# EAGLE design TOS100-Shield_v16 (EAGLE 7.7.0)
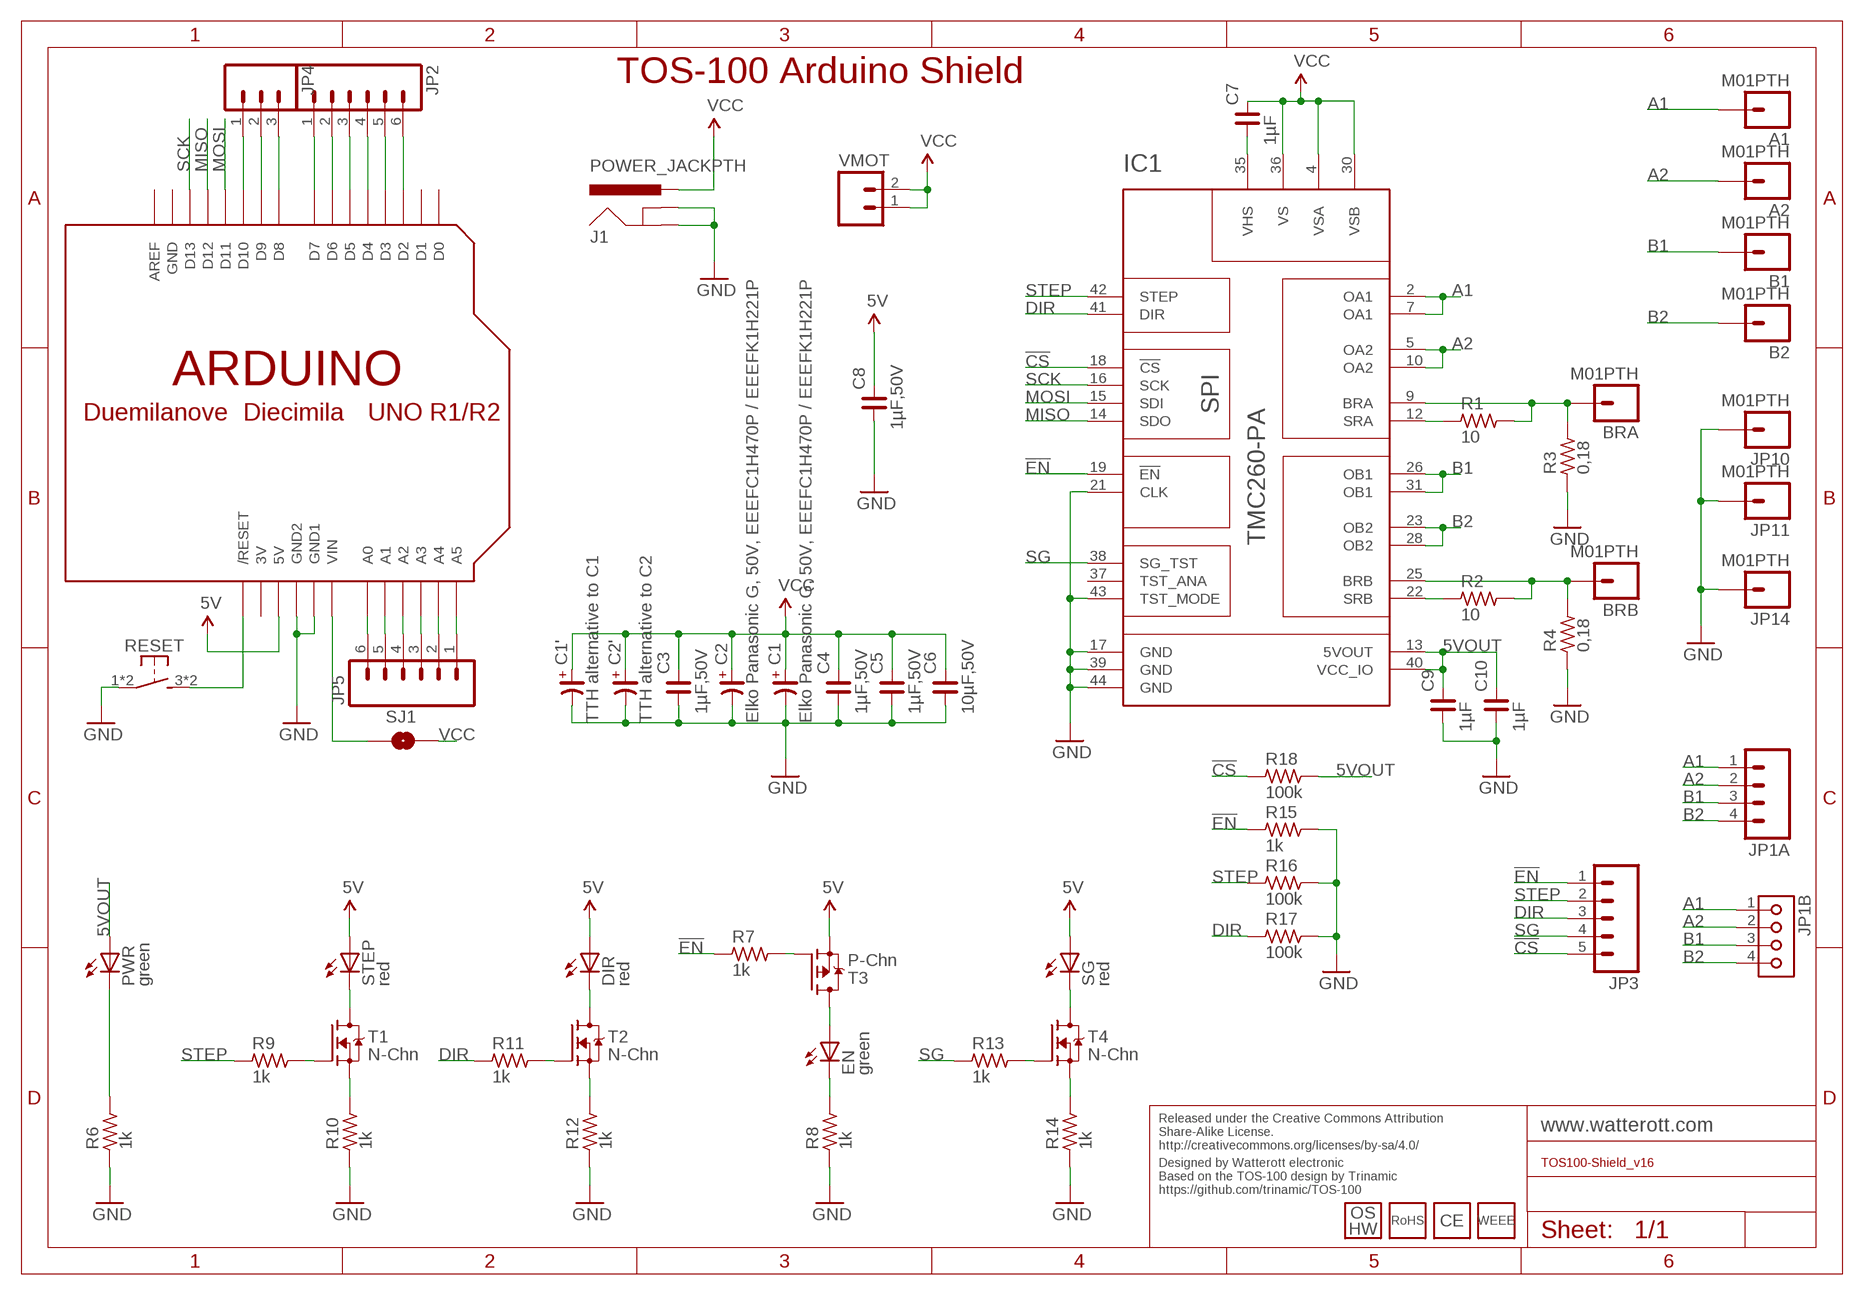
[diagram p0: schematic, sheet 1]

## Parts
A1  M01PTH  [1X01]
A2  M01PTH  [1X01]
ARD  ARDUINOUNO  [ARDUINO]
B1  M01PTH  [1X01]
B2  M01PTH  [1X01]
BRA  M01PTH  [1X01]
BRB  M01PTH  [1X01]
C1  Elko Panasonic G, 50V, EEEFC1H470P / EEEFK1H221P  CP_SV-G  [CSV-G]
C1'  TTH alternative to C1  CP_E-035X100  [CE-035X100]
C2  Elko Panasonic G, 50V, EEEFC1H470P / EEEFK1H221P  CP_SV-G  [CSV-G]
C2'  TTH alternative to C2  CP_E-035X100  [CE-035X100]
C3  1µF,50V  C_0603  [C0603]
C4  1µF,50V  C_0603  [C0603]
C5  1µF,50V  C_0603  [C0603]
C6  10µF,50V  C_1206  [C1206]
C7  1µF  C_0603  [C0603]
C8  1µF,50V  C_0603  [C0603]
C9  1µF  C_0603  [C0603]
C10  1µF  C_0603  [C0603]
DIR  red  LED-0603  [C0603]
EN  green  LED-0603  [C0603]
IC1  TMC260-PA  [PQFP44_WITH_PADS]
J1  POWER_JACKPTH  [POWER_JACK_PTH]
JP1A  M04SCREW  [SCREWTERMINAL-3.5MM-4]
JP1B  KK4H  [KK-H-4]
JP2  M06SIP  [1X06]
JP3  M05PTH  [1X05]
JP4  M03PTH  [1X03]
JP5  M06SIP  [1X06]
JP10  M01PTH  [1X01]
JP11  M01PTH  [1X01]
JP14  M01PTH  [1X01]
LOGO1  LOGO_OSHW-5  [OSHW_5MM]
LOGO2  LOGO_CE-2  [CE_2MM]
LOGO3  LOGO_WEEE-4  [WEEE_4MM]
LOGO4  LOGO_ROHS-2  [ROHS_2MM]
PWR  green  LED-0603  [C0603]
R1  10  R_0603  [R0603]
R2  10  R_0603  [R0603]
R3  0,18  R_2512  [R2512]
R4  0,18  R_2512  [R2512]
R6  1k  R_0603  [R0603]
R7  1k  R_0603  [R0603]
R8  1k  R_0603  [R0603]
R9  1k  R_0603  [R0603]
R10  1k  R_0603  [R0603]
R11  1k  R_0603  [R0603]
R12  1k  R_0603  [R0603]
R13  1k  R_0603  [R0603]
R14  1k  R_0603  [R0603]
R15  1k  R_0603  [R0603]
R16  100k  R_0603  [R0603]
R17  100k  R_0603  [R0603]
R18  100k  R_0603  [R0603]
RESET  PTS645SH50SMTR92-Grey  SW-TACTILE-6X6_SMD  [SW6X6_SMD]
SG  red  LED-0603  [C0603]
SJ1  SOLDERJUMPERNO  [SJ_2S-NO]
STEP  red  LED-0603  [C0603]
T1  N-Chn  MOSFET-N-SOT23  [SOT23]
T2  N-Chn  MOSFET-N-SOT23  [SOT23]
T3  P-Chn  MOSFET-P-SOT23  [SOT23]
T4  N-Chn  MOSFET-N-SOT23  [SOT23]
VMOT  M021X02_NO_SILK  [1X02_NO_SILK]

## Nets
5V: ARD.5V C8.2 DIR.A SG.A STEP.A T3.2(S)
5VOUT: C9.2 C10.2 IC1.13(5VOUT) IC1.40(VCC_IO) PWR.A R18.2
!CS: IC1.18(!CS) JP3.5 R18.1
!EN: IC1.19(!EN) JP3.1 R7.1 R15.1
A1: A1.1 IC1.2(OA1) IC1.7(OA1) JP1A.1 JP1B.1
A2: A2.1 IC1.5(OA2) IC1.10(OA2) JP1A.2 JP1B.2
B1: B1.1 IC1.26(OB1) IC1.31(OB1) JP1A.3 JP1B.3
B2: B2.1 IC1.23(OB2) IC1.28(OB2) JP1A.4 JP1B.4
DIR: IC1.41(DIR) JP3.3 R11.1 R17.1
GND: ARD.GND1 ARD.GND2 C1'.- C1.- C2'.- C2.- C3.1 C4.1 C5.1 C6.1 C8.1 C9.1 C10.1 IC1.17(GND) IC1.21(CLK) IC1.39(GND) IC1.43(TST_MODE) IC1.44(GND) J1.GND J1.GNDBREAK JP10.1 JP11.1 JP14.1 R3.1 R4.1 R6.1 R8.1 R10.1 R12.1 R14.1 R15.2 R16.2 R17.2 RESET.1 RESET.2(P1)
MISO: ARD.D12 IC1.14(SDO)
MOSI: ARD.D11 IC1.15(SDI)
N$1: ARD.D10 JP4.1
N$2: ARD.D9 JP4.2
N$3: ARD.D8 JP4.3
N$4: ARD.D7 JP2.1
N$5: ARD.D6 JP2.2
N$6: ARD.D5 JP2.3
N$7: ARD.D4 JP2.4
N$8: ARD.D3 JP2.5
N$9: ARD.D2 JP2.6
N$10: ARD.A5 JP5.1
N$11: ARD.A4 JP5.2
N$12: ARD.A3 JP5.3
N$13: ARD.A2 JP5.4
N$14: ARD.A1 JP5.5
N$15: ARD.A0 JP5.6
N$16: R9.2 T1.1(G)
N$17: ARD.RESET(/RESET) RESET.3(S1) RESET.4(S1)
N$19: STEP.C T1.3(D)
N$20: R10.2 T1.2(S)
N$22: PWR.C R6.2
N$24: R11.2 T2.1(G)
N$25: DIR.C T2.3(D)
N$26: R12.2 T2.2(S)
N$27: EN.A T3.3(D)
N$28: BRA.1 IC1.9(BRA) R1.2 R3.2
N$29: IC1.12(SRA) R1.1
N$30: BRB.1 IC1.25(BRB) R2.2 R4.2
N$31: IC1.22(SRB) R2.1
N$35: EN.C R8.2
N$36: R7.2 T3.1(G)
N$38: R13.2 T4.1(G)
N$39: SG.C T4.3(D)
N$40: R14.2 T4.2(S)
SCK: ARD.D13 IC1.16(SCK)
SG: IC1.38(SG_TST) JP3.4 R13.1
STEP: IC1.42(STEP) JP3.2 R9.1 R16.1
VCC: C1'.+ C1.+ C2'.+ C2.+ C3.2 C4.2 C5.2 C6.2 C7.2 IC1.4(VSA) IC1.30(VSB) IC1.36(VS) J1.PWR SJ1.2 VMOT.1 VMOT.2
VHS: C7.1 IC1.35(VHS)
VIN: ARD.VIN SJ1.1
Unconnected: ARD.AREF ARD.D0 ARD.D1 IC1.37(TST_ANA)

## Notes on the sheet
- TOS-100 Arduino Shield
- Released under the Creative Commons Attribution 
  Share-Alike License.
  http://creativecommons.org/licenses/by-sa/4.0/
- Designed by Watterott electronic
  Based on the TOS-100 design by Trinamic
  https://github.com/trinamic/TOS-100

## Power pins joined to a net without a drawn wire
3V: ARD.3V
GND: ARD.GND

## Library data of the parts
A1 A2 B1 B2 BRA BRB JP10 JP11 JP14 = SparkFun:M01: Header 1 Standard 1-pin 0.1" header. Use with straight break away headers (SKU : PRT-00116), right angle break away headers (PRT-00553), swiss pins (PRT-00743), machine pins (PRT-00117), and female headers (PRT-00115).
ARD = adafruit:ARDUINO: Arduino Diecimila/Duemilanove Make a shield with ease, this package has all the named pins as well as the two mounting drill holes and an outline of the USB and DC power connector. The outline is on the DIMENSION layer, so if your board house uses it they will cut the outline to match. http://www.ladyada.net/library/pcb/eaglelibrary.html
C1 C1' C2 C2' = rc-master:CP_: POLARIZED CAP
C3-C10 = rc-master-smd:C_: NON-POLARIZED CAP
DIR EN PWR SG STEP = we-opto:LED: LED red, green, blue -> 0603
IC1 = trinamic-2:TMC260-PA: TRINAMIC Energy Efficient Microstep Driver for up to 1.7A with coolStep™ Information given in this library is believed to be accurate and reliable. However no warranty is given for its correctness. Datasheet for TMC260/261/262 <http://www.trinamic.com/tmc/media/Downloads/integrated_circuits/TMC262/TMC260_TMC261_TMC262_datasheet.pdf> Description Energy Efficient Microstep Driver for up to 1.7A with coolStep™ The TMC260 is the first energy efficient high precision microstepping driver IC for bipolar stepper motors with integrated power MOSFETs. The unique high resolution sensorless load detection stallGuard2™ is used to for the world™s first integrated load dependent current control feature called coolStep™. The ability to read out the load and detect an overload makes the TMC260 an optimum choice for drives where a high reliability is desired at a low cost. The new patented spreadCycle PWM mixed decay chopper scheme ensures best zero crossing performance as well as high speed operation. The TMC260 can be driven with Step & Direction signals as well as by serial SPI™ interface. Using the microPlyer allows to operate the motor with highest 256 ™Step smoothness reducing the input frequency to 16 ™Steps. A full set of protection and diagnostic features makes this device very rugged. It directly drives stepper motors with up to 1.7A. This way it reaches highest energy efficiency and allows driving of a high motor current without cooling measures even at high environment temperatures. Specifications Main characteristics 2-phase bipolar stepper motor driver stallGuard2™ sensorless load detection coolStep™ load dependent current control save up to 80% energy spreadCycle hysteresis PWM chopper best current zero crossing performance best sine wave form 256 ™Steps/fullstep (51200 pos/rev.) with a standard 200 step motor microPlyer 16-to-256 ™Step multiplyer full protection and diagnostics lowest power dissipation programmable slope control for low EME standby and shutdown mode stall / load detection output Low power consumption via low RDS-ON power stage Interface Step & Direction easy-to-use SPI™ (20bit) Electrical Data up to 1.7A coil current (peak) 9V to 40V motor supply 3.3V or 5V operation for digital part Package TQFP44 10x10 mm² package RoHS compliant
J1 = SparkFun:POWER_JACK: Power Jack This is the standard 5.5mm barrel jack for power. The PTH is the most common, proven, reliable, footprint. All others are experimental. The Slot footprint only works if the mill layer is transmitted to the PCB fab house so be warned. Spark Fun Electronics SKU : PRT-00119. Mating wall wart : TOL-00298 (and others)
JP1A = SparkFun:M04: Header 4 Standard 4-pin 0.1" header. Use with straight break away headers (SKU : PRT-00116), right angle break away headers (PRT-00553), swiss pins (PRT-00743), machine pins (PRT-00117), and female headers (PRT-00115). Molex polarized connector foot print use with SKU : PRT-08231 with associated crimp pins and housings.
JP1B = molex-kk:KK4*
JP2 JP5 = SparkFun:M06: Header 6 Standard 6-pin 0.1" header. Use with straight break away headers (SKU : PRT-00116), right angle break away headers (PRT-00553), swiss pins (PRT-00743), machine pins (PRT-00117), and female headers (PRT-00115). Molex polarized connector foot print use with SKU : PRT-08094 with associated crimp pins and housings. NOTES ON THE VARIANTS LOCK and LOCK_LONGPADS... This footprint was designed to help hold the alignment of a through-hole component (i.e. 6-pin header) while soldering it into place. You may notice that each hole has been shifted either up or down by 0.005 of an inch from it's more standard position (which is a perfectly straight line). This slight alteration caused the pins (the squares in the middle) to touch the edges of the holes. Because they are alternating, it causes a "brace" to hold the component in place. 0.005 has proven to be the perfect amount of "off-center" position when using our standard breakaway headers. Although looks a little odd when you look at the bare footprint, once you have a header in there, the alteration is very hard to notice. Also, if you push a header all the way into place, it is covered up entirely on the bottom side. This idea of altering the position of holes to aid alignment will be further integrated into the Sparkfun Library for other footprints. It can help hold any component with 3 or more connection pins.
JP3 = SparkFun:M05: Header 5 Standard 5-pin 0.1" header. Use with straight break away headers (SKU : PRT-00116), right angle break away headers (PRT-00553), swiss pins (PRT-00743), machine pins (PRT-00117), and female headers (PRT-00115). Molex polarized connector foot print use with SKU : PRT-08230 with associated crimp pins and housings.
JP4 = SparkFun:M03: Header 3 Standard 3-pin 0.1" header. Use with straight break away headers (SKU : PRT-00116), right angle break away headers (PRT-00553), swiss pins (PRT-00743), machine pins (PRT-00117), and female headers (PRT-00115). Molex polarized connector foot print use with SKU : PRT-08232 with associated crimp pins and housings.
LOGO1 = we-symbol:LOGO_OSHW: Open-Source-Hardware Logo
LOGO2 = we-symbol:LOGO_CE: CE Logo
LOGO3 = we-symbol:LOGO_WEEE: WEEE Logo
LOGO4 = we-symbol:LOGO_ROHS: RoHS Logo
R1-R4 R6-R18 = rc-master-smd:R_: RESISTOR
RESET = we-switch:SW-TACTILE: Tactile Switche
SJ1 = SparkFun:SOLDERJUMPER: Solder Jumper Standard SMD solder jumper. Used to automate production. Two varients : Normally Open and Normally Closed are the same, but have different paste layers. NC will have a large amount of paste and should jumper during reflow.
T1 T2 T4 = we-transistor:MOSFET-N: N-Channel MOSFET SOT23 N-Chn MOSFET TSM3404, TSM240N03 (Vgs>=+/-20V, Vds<=30V, Id>=3A + Rds<=0.05Ohm @ Vgs=4.5V) BSS138 (Vgs>=+/-20V, Vds<=40V, Id>=0.2A + Rds<=3Ohm @ Vgs=4.5V) SOT223 Low Side Switch with Protection (Infineon) BSP76 (Vin=0...10V, Vds<=42V, Id=1.4A + Rds=0.2Ohm @ Vin=5V) BSP77 (Vin=0...10V, Vds<=42V, Id=2.2A + Rds=0.1Ohm @ Vin=5V) D²Pak Low Side Switch with Protection (Infineon) BTS117TC (Vin=0...10V, Vds<=60V, Id=3.5A + Rds=0.12Ohm @ Vin=5V) BTS133TC (Vin=0...10V, Vds<=60V, Id=7A + Rds=0.06Ohm @ Vin=5V) BTS141TC (Vin=0...10V, Vds<=60V, Id=12A + Rds=0.03Ohm @ Vin=5V) BTS3018TC (Vin=0...10V, Vds<=60V, Id=6A + Rds=0.02Ohm @ Vin=5V)
T3 = we-transistor:MOSFET-P: P-Channel MOSFET SOT23 P-Chn MOSFET TSM3401 (Vgs>=+/-20V, Vds>=30V, Id>=2A + Rds<=0.1Ohm @ Vgs=4.5V)
VMOT = SparkFun:M02: Header 2 Standard 2-pin 0.1" header. Use with straight break away headers (SKU : PRT-00116), right angle break away headers (PRT-00553), swiss pins (PRT-00743), machine pins (PRT-00117), and female headers (PRT-00115). Molex polarized connector foot print use with SKU : PRT-08233 with associated crimp pins and housings.

## Board
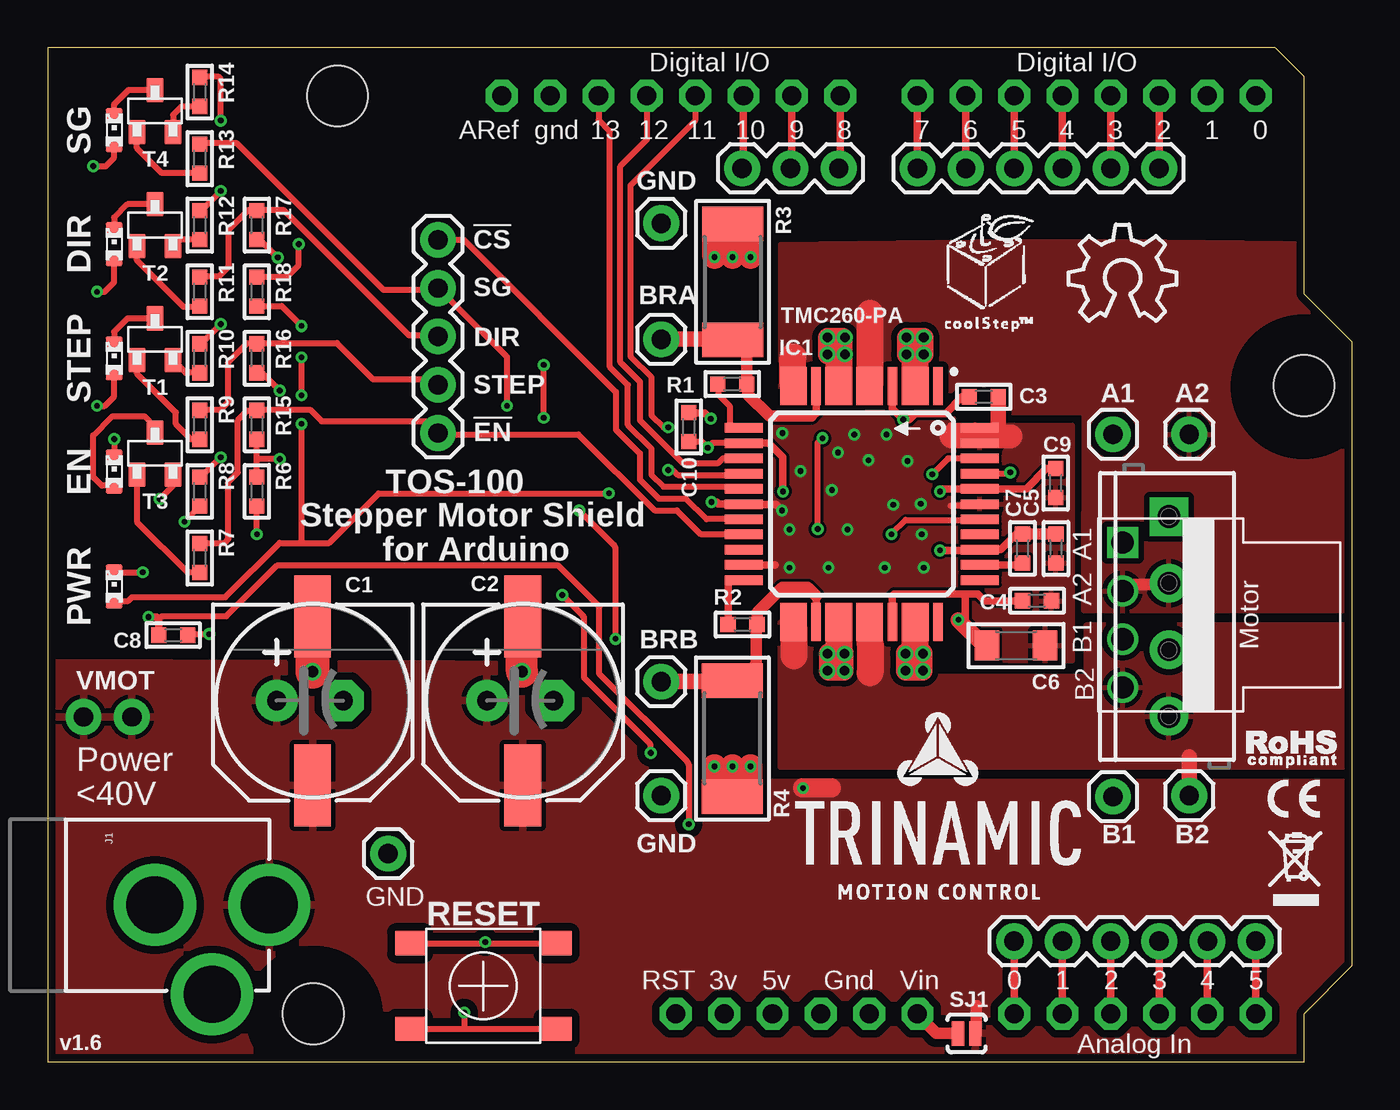
[diagram p1: board, top side]
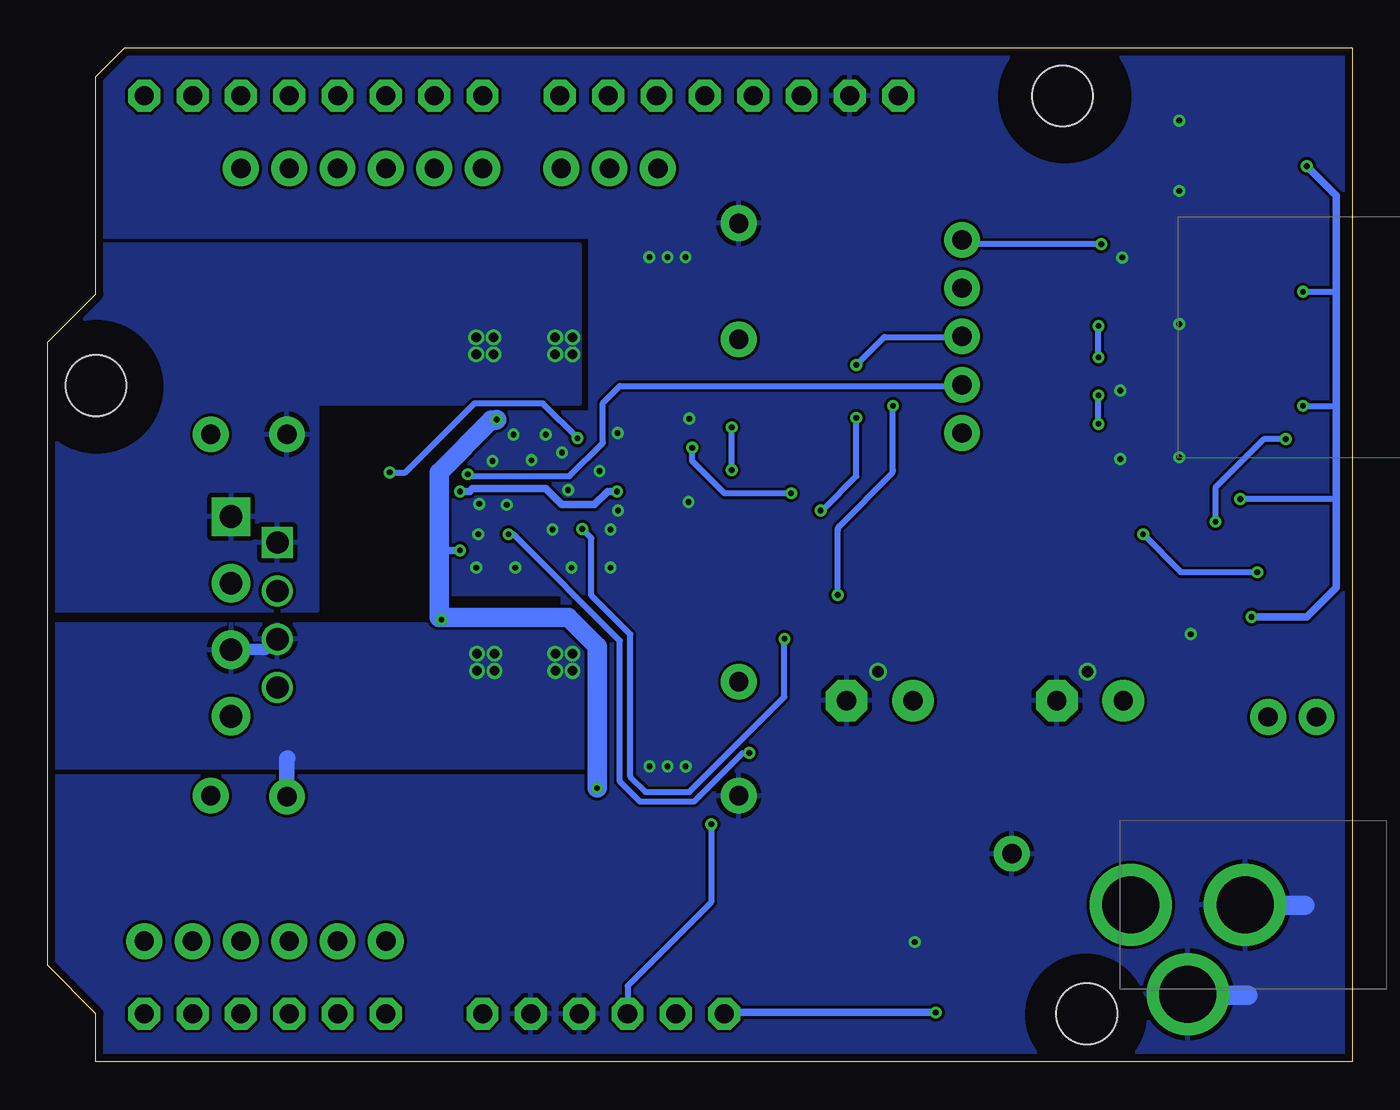
[diagram p2: board, bottom side, seen from below]

Size 68.58 x 53.34 mm. Coordinates in mm from the lower left corner, seen from the top.
Copper layers (1*16): Top 0.035mm / dielectric 1.5mm / Bottom 0.035mm
Design rules "we-dru-2-layer": minimum track width 6mil, minimum drill 0.3mm, track to track 6mil, track to pad 7mil, pad to pad 8mil, via to via 8mil, smd to smd 4mil, copper to edge 0.4mm, drill to drill 0.4mm, minimum pad ring 0.18mm, minimum via ring 0.16mm, stop-mask expansion 0.1mm, vias tented up to drill 0.5mm, thermal gap 0.25mm
tRestrict: area 10.8,-0.7 to 17.2,5.7; area 62.5,32 to 69.5,39; area 11.6,47.2 to 18.6,54.2
bRestrict: area 10.8,-0.7 to 17.2,5.7; area 62.5,32 to 69.5,39; area 11.6,47.2 to 18.6,54.2

### Footprints (pad centres in the part's own frame; a part is rotated, then mirrored left to right if it is on the bottom)
1X01 = drill 1.016 pad 1.88: 1 0,0
ARDUINO = drill 1 pad 1.676 octagon: 3V 35.56,2.54; 5V 38.1,2.54; A0 50.8,2.54; A1 53.34,2.54; A2 55.88,2.54; A3 58.42,2.54; A4 60.96,2.54; A5 63.5,2.54; AREF 23.876,50.8; D0 63.5,50.8; D1 60.96,50.8; D2 58.42,50.8; D3 55.88,50.8; D4 53.34,50.8; D5 50.8,50.8; D6 48.26,50.8; D7 45.72,50.8; D8 41.656,50.8; D9 39.116,50.8; D10 36.576,50.8; D11 34.036,50.8; D12 31.496,50.8; D13 28.956,50.8; GND 26.416,50.8; GND1 43.18,2.54; GND2 40.64,2.54; RESET 33.02,2.54; VIN 45.72,2.54 | hole 3.2: 15.24,50.8; 66.04,35.56; 13.97,2.54
CSV-G = smd 4.318 x 1.93: + -4.445,0; - 4.445,0
CE-035X100 = drill 1.016 pad 2.184: + -1.905,0 | drill 1.016 pad 2.184 octagon: - 1.587,0
C0603 = smd 0.8 x 0.8: 1 -0.762,0; 2 0.762,0
C1206 = smd 1.3 x 1.6: 1 -1.524,0; 2 1.524,0
C0603' = smd 0.9 x 0.8: A 0,-0.75; C 0,0.75
PQFP44_WITH_PADS = smd 2 x 0.5: 1 -6.327,4.254; 4 -6.327,1.854; 9 -6.327,-2.146; 25 6.073,-2.146; 30 6.073,1.854; 33 6.073,4.254 | smd 2 x 1.4: 2 -6.327,3.06; 5 -6.327,0.66; 7 -6.327,-0.965; 10 -6.327,-3.34; 23 6.073,-3.34; 26 6.073,-0.965; 28 6.073,0.66; 31 6.073,3.06 | smd 0.5 x 2: 12 -4.127,-5.946; 13 -3.327,-5.946; 14 -2.527,-5.946; 15 -1.727,-5.946; 16 -0.927,-5.946; 17 -0.127,-5.946; 18 0.673,-5.946; 19 1.473,-5.946; 20 2.273,-5.946; 21 3.073,-5.946; 22 3.873,-5.946; 34 3.873,6.454; 35 3.073,6.454; 36 2.273,6.454; 37 1.473,6.454; 38 0.673,6.454; 39 -0.127,6.454; 40 -0.927,6.454; 41 -1.727,6.454; 42 -2.527,6.454; 43 -3.327,6.454; 44 -4.127,6.454
POWER_JACK_PTH = drill 2.997 pad 4.318: GND 0,7.7; GNDBREAK 4.7,10.7; PWR 0,13.7
SCREWTERMINAL-3.5MM-4 = drill 1.2 pad 2.032 square: 1 0,0 | drill 1.2 pad 2.032: 2 3.5,0; 3 7,0; 4 10.5,0
KK-H-4 = drill 1.168 square: 1 0,3.81 | drill 1.168: 2 0,1.27; 3 0,-1.27; 4 0,-3.81
1X06 = drill 1.016 pad 1.88: 1 0,0; 2 2.54,0; 3 5.08,0; 4 7.62,0; 5 10.16,0; 6 12.7,0
1X05 = drill 1.016 pad 1.88: 1 0,0; 2 2.54,0; 3 5.08,0; 4 7.62,0; 5 10.16,0
1X03 = drill 1.016 pad 1.88: 1 0,0; 2 2.54,0; 3 5.08,0
R0603 = smd 0.8 x 0.8: 1 -0.762,0; 2 0.762,0
R2512 = smd 1.8 x 3.2: 1 -3.048,0; 2 3.048,0
SW6X6_SMD = smd 1.6 x 1.3: 1 -3.85,2.25; 2 3.85,2.25; 3 -3.85,-2.25; 4 3.85,-2.25
SJ_2S-NO = smd 0.635 x 1.27: 1 -0.45,0; 2 0.45,0
SOT23 = smd 1.3 x 0.9: 1 -1.1,0.95; 2 -1.1,-0.95; 3 1.1,0
1X02_NO_SILK = drill 1.016 pad 1.88: 1 0,0; 2 2.54,0

### Placement (x,y rotation side)
A1  56,33 0 top
A2  60,33 0 top
ARD  0,0 0 top
B1  56,13.95 0 top
B2  60,14 0 top
BRA  32.25,38 0 top
BRB  32.25,20 0 top
C1  13.93,18.98 90 top
C1'  25,19 0 top
C2  24.98,18.98 90 top
C2'  13.95,19 0 top
C3  49.2,34.98 180 top
C4  52,24.25 180 top
C5  53,27 90 top
C6  50.9,21.9 180 top
C7  51.24,27 90 top
C8  6.6,22.45 180 top
C9  52.98,30.44 90 top
C10  33.7,33.38 270 top
DIR  red  [C0603']  3.5,43 0 top
EN  green  [C0603']  3.5,31.05 0 top
IC1  42.55,29.21 270 top
J1  -2.06,8.26 270 top
JP1A  58.94,28.68 270 top
JP1B  56.5,23.5 0 top
JP2  45.72,46.99 0 top
JP3  20.52,33.07 90 top
JP4  36.51,46.99 0 top
JP5  63.5,6.35 180 top
JP10  32.25,14 0 top
JP11  32.25,44.1 0 top
JP14  17.9,10.95 0 top
LOGO1  56.5,41.5 0 top
LOGO2  65.5,13.85 0 top
LOGO3  65.55,10.2 0 top
LOGO4  65.4,16.45 0 top
PWR  green  [C0603']  3.5,25 0 top
R1  35.98,35.65 0 top
R2  36.52,23 0 top
R3  36.01,41.02 270 top
R4  35.99,17 90 top
R6  11,30 270 top
R7  8,26.5 270 top
R8  8,30 270 top
R9  8,33.5 270 top
R10  8,37 270 top
R11  8,40.5 270 top
R12  8,44 270 top
R13  8,47.5 270 top
R14  8,51 270 top
R15  11,33.5 270 top
R16  11,37 270 top
R17  11,44 270 top
R18  11,40.5 270 top
RESET  22.9,4 0 top
SG  red  [C0603']  3.5,49 0 top
SJ1  48.3,1.5 0 top
STEP  red  [C0603']  3.5,37 0 top
T1  5.65,38 90 top
T2  5.65,44 90 top
T3  5.65,32 90 top
T4  5.65,50 90 top
U$5  [LOGO]  39.3,8.55 0 top
U$9  [COOLSTEP]  46.85,38.25 0 top
VMOT  1.89,18.14 0 top

### Tracks (layer width: path | path; a pad name or v marks a point on that pad's centre or on a via)
5V  (via drill 0.3)
  Top 0.305: 5.84,23.26 6.03,23.45 9.4,23.45 12.05,26.1 26.85,26.1 29,23.95 29,20.4 33.61,15.79 arc-45 33.7,15.57 v33.7,12.5 | v2.4,47.1 3.05,47.1 3.5,47.55 SG.A | v2.6,40.5 3,40.5 3.5,41 DIR.A | v2.6,34.5 3,34.5 3.5,35 STEP.A | T3.2 6.6,30.3 v5.9,29.6
  Top 0.406: C8.2 5.84,23.26 5.7,23.4 v5.3,23.4
  Bottom 0.305: v5.9,29.6 0.92,29.6 0.92,29.73 0.85,29.8 | v33.7,12.5 33.7,8.4 38.1,4 ARD.5V | v2.6,40.5 0.9,40.5 0.85,40.45 | v2.6,34.5 0.9,34.5 0.85,34.55
  Bottom 0.406: v5.3,23.4 2.4,23.4 0.85,24.95 0.85,29.8 0.85,34.55 0.85,40.45 0.85,45.55 v2.4,47.1
5VOUT  (via drill 0.3)
  Top 0.305: v34.7,32.3 34.7,32.4 | 13.35,27.3 14.8,27.3 17.4,29.9 v29.5,29.9 | R18.2 12.3,39.75 v13.35,38.7 | v13.35,35.05 v13.35,37.05 | 13.35,27.3 v13.35,33.55 | 13.35,27.3 12.2,27.3 9.35,24.45 4.45,24.45 4.25,24.25 PWR.A | 36.61,32.55 34.95,32.55 v34.7,32.3 | C10.2 34.38,32.62 v34.7,32.3 | IC1.13 36.69,32.54 36.7,32.55
  Top 0.406: v38.65,30 38.65,31.8 37.9,32.55 36.7,32.55 36.61,32.55 | C9.2 52.5,31.2 51.44,30.14 IC1.40 47.04,30.14 v46.9,30
  Bottom 0.305: v29.5,29.9 33,29.9 34.7,31.6 v34.7,32.3 | v13.35,37.05 v13.35,38.7 | v13.35,33.55 v13.35,35.05
  Bottom 0.406: v46.9,30 46.4,30 46.25,30.15 42.4,30.15 41.55,29.3 39.85,29.3 39.15,30 v38.65,30
!CS  (via drill 0.3)
  Top 0.305: R18.1 11,41.3 12.6,41.3 13.2,41.9 v13.2,43 | JP3.5 21.87,43.23 29.88,35.23 29.88,33.25 31.12,32 31.12,30.62 32.12,29.62 33.55,29.62 34.64,28.54 IC1.18
  Bottom 0.305: v13.2,43 20.3,43 JP3.5
!EN
  Top 0.305: R7.1 8,27.3 9.3,27.3 9.5,27.5 9.5,30.5 10,31 10,33.75 10.5,34.25 10.99,34.25 R15.1 11.04,34.3 13.8,34.3 14.4,33.7 19.89,33.7 JP3.1 20.59,33 27.9,33 31.9,29 33.08,29 34.34,27.74 IC1.19
A1  (via drill 0.5)
  Top 0.406: IC1.7 41.58,35.73 41.6,35.75 | IC1.2 45.6,35.74 45.6,35.75 | 45.6,37.75 45.7,37.75 v46.05,38.1
  Top 0.813: 41.1,38.1 41.8,38.1 v41.9,38.1 v41.9,37.2 41.6,37.2 v41,37.2
  Top 1.016: v41,37.2 v41,38.1 41.8,38.1 41.8,37.4 41.6,37.2 | v46.05,37.2 v46.05,38.1 v45.15,38.1 v45.15,37.2
  Top 1.422: 41.6,35.75 41.6,37.2 41.6,37.55 | 45.6,35.75 45.6,37.75
  pour Bottom: 69,42.98 40.62,42.98 40.62,34.62 54.42,34.62 54.42,23.75 69,23.75
A2
  Top 0.61: 58.8,25.1 56.75,25.1 56.4,24.75 56.35,24.75 56.5,24.9
  Top 1.422: 43.23,35.67 43.23,39.38 | 39.17,35.65 39.17,37.08
  pour Top (isolate 0.305): 38.5,34.85 48.15,35.05 48.15,34.15 54.45,34.15 54.42,23.75 69.03,23.75 69,42.98 arc2 38.5,42.98
B1  (via drill 0.5)
  Top 0.406: v41.9,21.46 41.85,21.42 41.7,21.42 41.58,21.3 | v45.1,20.56 45.1,20.61 45.49,21
  Top 1.016: 41.85,21.5 41.85,21.42 41.85,20.55 41.05,20.55 41.05,21.5 | 45.6,21 45.49,21 | v45.1,20.55 v46,20.55 46,21.5 45.1,21.5 v45.1,21.46 v45.1,20.56 v45.1,20.55
  Top 1.422: 45.6,21 IC1.31 | IC1.26 41.58,21.3 41.58,21.12 41.6,21.1
  Bottom 0.61: 58.8,21.7 57.15,21.7 56.55,22.3
  Bottom 0.813: B1.1 56,15.95 55.95,16
  other vias: 40.99,20.56 40.99,21.46 41.9,20.56 46,21.46
  pour Bottom: 40.45,15.5 69,15.5 69,23 41.75,23 40.4,21.93 40.4,21.1
B2
  Top 0.813: JP1B.4 56.5,19.62 | B2.1 60,16.05
  Top 1.422: 43.23,22.01 43.23,20.47 | 39.23,22.75 39.23,21.38
  pour Top (isolate 0.305): 38.5,23.12 46.4,22.9 46.4,20.3 54.6,20.3 54.6,23 69,23 69.03,15.5 38.5,15.5 arc1
DIR  (via drill 0.3)
  Top 0.305: v26.07,33.88 v26.07,36.65 | R11.1 8,41.3 9,41.3 9.5,41.8 9.5,43.75 10.55,44.8 11.05,44.8 | 11.05,44.8 12.4,44.8 19,38.2 20.5,38.2 20.5,38.17 JP3.3 | v29.85,22.25 29.85,26.97 arc45 29.76,27.19 v27.95,29 | IC1.41 50.54,30.94 v50.6,31 | R17.1 11.01,44.76 11.05,44.8 | v40.48,28.02 40.48,32.55 v40.73,32.8
  Bottom 0.305: v26.07,33.88 26.07,30.8 27.82,29.05 arc45 v27.95,29 | v29.85,22.25 29.85,19.2 34.85,14.2 37.15,14.2 37.95,15 37.95,22.48 40,24.53 40,27.55 v40.48,28.02 | v50.6,31 49.77,31 46.15,34.62 42.55,34.62 v40.73,32.8 | JP3.3 20.55,38.12 24.6,38.12 v26.07,36.65
GND  (via drill 0.3, 0.6)
  Top 0.254: 36,43.87 36.01,43.87 R3.1 | v35.05,15.54 35,15.5 35.05,15.5
  Top 0.305: 47.45,29.25 48.75,29.25 | 47.45,32.5 48.75,32.5 | 47.45,33.48 48.75,33.48 | v9.1,49.5 9.1,51.7 9,51.8 8,51.8 R14.1 | R12.1 8,44.8 8.1,44.8 v9.1,45.8 | R17.2 11,43.2 11.2,43.2 v12.1,42.3 | R10.1 8,37.8 8.1,37.8 v9.1,38.8 | R16.2 11,36.2 11.3,36.2 v12.2,35.3 | 11,32.7 R15.2 11,31.75 | 8,30.8 8.1,30.8 v9.1,31.8 | R6.1 11,31.75 | v12.2,31.7 11.05,31.7 11,31.75 | RESET.1 23.15,6.25 | 23.15,6.25 RESET.2 | v23,6.3 23.1,6.3 23.15,6.25 | C8.1 7.42,22.5 v8.5,22.5 | 33.75,34.12 33.72,34.12 C10.1 | IC1.17 36.54,29.34 36.5,29.3
  Top 0.406: IC1.21 38.25,26.14 38.25,26.12 | R8.1 8,30.8 | 33.75,34.12 34.55,34.12 v34.85,33.83 | 36.5,29.3 38.29,29.3 v38.59,29 | 35.2,29.4 35.25,29.35 36.7,29.35 | v34.89,29.44 35.16,29.44 35.2,29.4 | 35.2,29.4 34.94,29.4 v34.9,29.45
  Top 0.813: C3.1 49.96,33.19 50.25,32.9
  Top 1.27: R4.1 v35.99,15.54 | v36,42.33 36,43.87 | v35.05,42.33 35.05,43.87 | v36.95,42.33 36.95,43.87 | 35.05,13.96 35.05,15.5 v35.05,15.54 | 36.95,13.96 v36.95,15.54 | 47.5,32.9 50.25,32.9 50.6,32.9
  Top 1.676: v24.93,20.53 24.93,23.38 C2.-
  Top 1.778: v13.93,20.53 C1.-
  Bottom 1.016: 2.51,8.24 5.71,8.24 | 5.5,3.5 8.5,3.5
  other vias: 38.62,33.07 39.57,31.07 45.9,29.34 38.99,26 41.05,26 43.99,26 45.95,27.75 46.05,26 44.45,29.3 45.2,31.59 44.09,32.99 43.15,31.64 42.4,32.99 41.55,32.05 41.22,30.07 38.99,28 42.05,28
  pour Bottom: 69,-1 -1.02,-1 -1.02,54.01 67,54.01 67,43.42 40.05,43.42 40.05,34.12 47.38,34.12 47.38,24.62 41.5,24.6 41.5,23.82 39.52,22.23 39.52,15 69,15
  pour Top: 38.02,25.02 38.02,33.8 38.35,34.12 47.52,34.23 47.65,33.5 53.85,33.5 53.85,21.05 47.1,21.1 47.1,23.9 46.75,24.23 46.83,24.8 38.35,24.7
MISO
  Top 0.305: IC1.14 36.51,31.74 36.5,31.75 35.5,31.75 35.25,31.5 33.38,31.5 31.12,33.75 31.12,35.77 30.1,36.8 30.1,47.1 31.5,48.5 ARD.D12
MOSI  (via drill 0.3)
  Top 0.305: IC1.15 36.56,30.94 36.5,30.88 33.12,30.88 32.88,31.12 v32.62,31.12 | ARD.D11 34.04,49.49 30.65,46.1 30.65,37.1 31.75,36 31.75,34 32.38,33.38 v32.62,33.38
  Bottom 0.305: v32.62,31.12 v32.62,33.38
N$1
  Top 0.406: ARD.D10 36.58,47.06 JP4.1
N$2
  Top 0.406: ARD.D9 39.12,47.06 JP4.2
N$3
  Top 0.406: ARD.D8 41.66,47.06 JP4.3
N$4
  Top 0.406: ARD.D7 JP2.1
N$5
  Top 0.406: ARD.D6 JP2.2
N$6
  Top 0.406: ARD.D5 JP2.3
N$7
  Top 0.406: ARD.D4 JP2.4
N$8
  Top 0.406: ARD.D3 JP2.5
N$9
  Top 0.406: ARD.D2 JP2.6
N$10
  Top 0.406: ARD.A5 JP5.1
N$11
  Top 0.406: ARD.A4 JP5.2
N$12
  Top 0.406: ARD.A3 JP5.3
N$13
  Top 0.406: ARD.A2 JP5.4
N$14
  Top 0.406: ARD.A1 JP5.5
N$15
  Top 0.406: ARD.A0 JP5.6
N$16
  Top 0.305: R9.2 7.56,32.74 6.75,33.55 6.75,34.15 4.7,36.2 T1.1
N$17  (via drill 0.3)
  Top 0.305: RESET.3 21.95,1.75 | 21.95,1.75 RESET.4 | v21.9,2.6 21.9,1.8 21.95,1.75
  Bottom 0.406: v21.9,2.6 32.96,2.6 ARD.RESET
N$19
  Top 0.305: T1.3 4.2,39.1 3.5,38.4 STEP.C
N$20
  Top 0.305: R10.2 7.26,36.24 T1.2
N$22  (via drill 0.3)
  Top 0.305: PWR.C v5,25.75 | v11,27.75 R6.2
  Bottom 0.305: v5,25.75 9,25.75 v11,27.75
N$24
  Top 0.305: R11.2 8,39.7 7.15,39.7 4.7,42.15 T2.1
N$25
  Top 0.305: T2.3 4.2,45.1 3.5,44.4 DIR.C
N$26
  Top 0.305: R12.2 6.94,43.24 T2.2
N$27
  Top 0.305: EN.A 2.85,30.3 2.4,30.75 2.4,32.95 3.4,33.95 5.1,33.95 5.6,33.45 5.6,33.15 T3.3
N$28
  Top 0.305: 36.75,35.95 R1.2 | 36.25,38 36.3,37.95
  Top 0.406: IC1.9 40.4,34.1 40.25,33.95 40.15,33.95 | 36.8,35.65 R1.2
  Top 0.61: 36.8,35.65 36.8,35.1 37.95,33.95 40.15,33.95 | 36.75,35.95 36.75,37.9 36.7,37.95 36.3,37.95
  Top 0.813: BRA.1 35.8,38 35.98,38
  Top 1.016: 35.8,38 35.83,37.97 R3.2 36.03,38 36.25,38
N$29
  Top 0.305: 35.9,33.4 35.85,33.45 35.85,34.5 35.25,35.1 35.25,35.65 R1.1
  Top 0.406: 35.9,33.4 36.54,33.4 IC1.12
N$30
  Top 0.406: 40.4,24.5 IC1.25 | 37.25,23.02 37.27,23.02 R2.2
  Top 0.61: 40.4,24.5 39.95,24.95 38.6,24.95 37.29,23.64 R2.2 | 37.25,23.02 37.25,20.9 36.4,20.05 R4.2
  Top 0.813: BRB.1 35.94,20 R4.2
N$31
  Top 0.406: R2.1 35.76,25.26 35.85,25.35 36.59,25.35 IC1.22
N$35  (via drill 0.3)
  Top 0.305: R8.2 8,29.2 v7.2,28.4 7.2,28.3 | v3.5,32.75 EN.C
  Bottom 0.305: v7.2,28.4 7.2,30.2 4.65,32.75 v3.5,32.75
N$36
  Top 0.305: 8,25.7 R7.2 7.36,25.74 4.7,28.4 T3.1
N$38
  Top 0.305: R13.2 6.01,46.74 4.7,48.05 T4.1
N$39
  Top 0.305: T4.3 4.25,51.1 3.5,50.35 SG.C
N$40
  Top 0.305: R14.2 7.04,50.24 6.6,49.8 T4.2
SCK
  Top 0.305: IC1.16 36.51,30.14 36.5,30.12 35.88,30.12 35.75,30.25 32.38,30.25 31.75,30.88 31.75,32.25 30.5,33.5 30.5,35.6 29.55,36.55 29.55,48.95 28.96,49.54 ARD.D13
SG  (via drill 0.3)
  Top 0.305: v44.35,27.75 45.1,28.5 48.88,28.5 | R13.1 8,48.3 9.95,48.3 17.65,40.6 20.43,40.6 JP3.4 24.15,37.06 v24.15,34.5 | v31.7,16.25 31.7,16.57 arc45 31.61,16.79 28.2,20.2 28.2,23.27 arc45 28.11,23.49 v27.05,24.55
  Top 0.406: 48.88,28.5 48.96,28.5 IC1.38
  Bottom 0.305: v27.05,24.55 27.05,27.97 arc45 26.96,28.19 24.24,30.91 arc-45 24.15,31.13 v24.15,34.5 | v31.7,16.25 32.05,16.25 34.6,13.7 37.45,13.7 38.5,14.75 38.5,22.15 44.1,27.75 v44.35,27.75
STEP  (via drill 0.3)
  Top 0.305: R9.1 8,34.3 9.1,34.3 9.5,34.7 9.5,36.8 10.46,37.76 R16.1 11,37.8 15.2,37.8 17.1,35.9 20.23,35.9 JP3.2 | IC1.42 47.34,31.74 v46.5,30.9
  Bottom 0.305: v46.5,30.9 46.4,30.8 41.15,30.8 39.4,32.55 39.4,34.65 38.5,35.55 20.85,35.55 20.79,35.61 JP3.2
VCC  (via drill 0.3)
  Top 0.406: C5.2 | 46.8,26.9 v46.9,26.9 48.96,26.9 IC1.36 50.09,26.94 50.9,27.75 51.22,27.75 C7.2 | 44.4,23.7 44.4,24.5 44.5,24.6 48.24,24.6 | 44.4,23.7 44.4,23.2 | v47.88,23.25 48.24,23.25 48.24,24.6 | 48.24,24.6 48.9,24.6 49.25,24.25 C4.2 | C3.2 48.08,34.98 47.2,34.1 45.6,34.1 45.27,33.77 v44.98,33.77 44.4,34.35 IC1.4 | IC1.30 44.4,23.7
  Top 0.61: C7.2 C5.2 | 48.8,1.46 48.8,2.93 48.82,2.95
  Top 0.813: C6.2 49.23,21.9 v47.88,23.25
  Top 1.016: v39.7,14.4 41.2,14.4
  Bottom 0.406: 48,23.38 v47.88,23.25 | 48,26.9 v46.9,26.9
  Bottom 1.016: v39.7,14.4 39.7,21.85 41.23,23.38 48,23.38 48,26.9 48,31 45.25,33.75 45,33.75 v44.98,33.77
  pour Top (isolate 0.406): -0.85,21 28.85,20.9 33.5,14.7 69.65,14.7 69.75,-0.88 -0.75,-0.88
VHS
  Top 0.406: IC1.35 51.13,26.14 C7.1
VIN
  Top 0.61: ARD.VIN 45.72,2.48 46.7,1.5 SJ1.1

### Text on the board
tNames: GND | !CS | SG | DIR | STEP | !EN | TOS-100 | Stepper Motor Shield | for Arduino | A1 | A2 | B1 | Motor | B2 | Power | <40V | GND | GND | v1.6
Reference: UL / mark | Silkscreen: 21 tPlace + 25 tNames